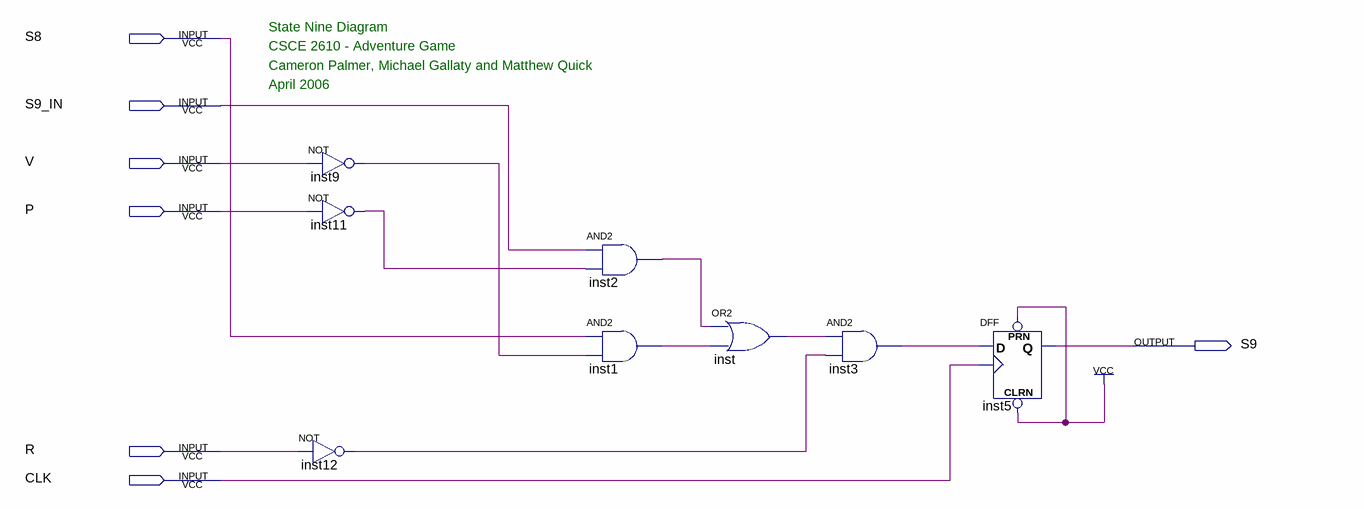
[diagram p0: schematic sheet]
// Quartus schematic state_nine.bdf as structural Verilog: 8 symbols, 7 pins
module state_nine (
  input  S8,
  input  S9_IN,
  input  V,
  input  P,
  input  R,
  input  CLK,
  output S9
);

  wire inst1_out, inst2_out, inst3_out, inst9_out, inst11_out, inst12_out, inst_out;

  not inst9 (inst9_out, V);
  not inst11 (inst11_out, P);
  not inst12 (inst12_out, R);
  and inst2 (inst2_out, S9_IN, inst11_out);
  and inst1 (inst1_out, S8, inst9_out);
  or inst (inst_out, inst2_out, inst1_out);
  and inst3 (inst3_out, inst_out, inst12_out);
  DFF inst5 (.CLRN(1'b1), .CLK(CLK), .D(inst3_out), .PRN(1'b1), .Q(S9));

  // Notes on the sheet:
  //   State Nine Diagram
  //   CSCE 2610 - Adventure Game
  //   Cameron Palmer, Michael Gallaty and Matthew Quick
  //   April 2006
endmodule
